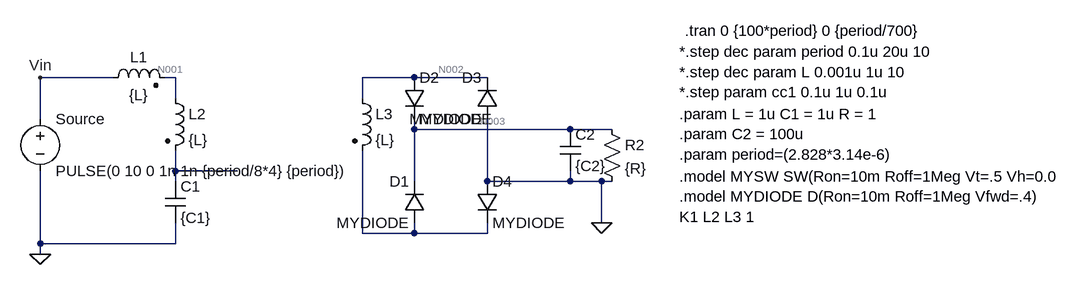
[diagram p0: schematic resonance_study.asc]
resonance_study.asc, the LTspice schematic file:
Version 4
SHEET 1 1688 680
WIRE -16 96 -128 96
WIRE 80 96 64 96
WIRE 448 96 368 96
WIRE 560 96 448 96
WIRE 80 128 80 96
WIRE 368 128 368 96
WIRE -128 160 -128 96
WIRE 448 176 448 160
WIRE 688 176 448 176
WIRE 752 176 688 176
WIRE 80 240 80 208
WIRE 176 240 80 240
WIRE 80 256 80 240
WIRE 448 256 448 176
WIRE 560 256 560 160
WIRE 688 256 688 240
WIRE 688 256 560 256
WIRE 736 256 688 256
WIRE 752 256 736 256
WIRE 736 320 736 256
WIRE 368 336 368 208
WIRE 448 336 448 320
WIRE 448 336 368 336
WIRE 560 336 560 320
WIRE 560 336 448 336
WIRE -128 352 -128 240
WIRE 80 352 80 320
WIRE 80 352 -128 352
WIRE -128 368 -128 352
FLAG -128 368 0
FLAG -128 96 Vin
FLAG 736 320 0
SYMBOL voltage -128 144 R0
WINDOW 123 0 0 Left 2
WINDOW 39 0 0 Left 2
SYMATTR InstName Source
SYMATTR Value PULSE(0 10 0 1n 1n {period/8*4} {period})
SYMBOL cap 64 256 R0
SYMATTR InstName C1
SYMATTR Value {C1}
SYMBOL ind2 -32 112 R270
WINDOW 0 32 56 VTop 2
WINDOW 3 5 56 VBottom 2
SYMATTR InstName L1
SYMATTR Value {L}
SYMATTR Type ind
SYMBOL ind2 64 112 R0
SYMATTR InstName L2
SYMATTR Value {L}
SYMATTR Type ind
SYMBOL ind2 352 112 R0
SYMATTR InstName L3
SYMATTR Value {L}
SYMATTR Type ind
SYMBOL res 736 160 R0
SYMATTR InstName R2
SYMATTR Value {R}
SYMBOL diode 464 320 R180
WINDOW 0 24 64 Left 2
WINDOW 3 24 0 Left 2
SYMATTR InstName D1
SYMATTR Value MYDIODE
SYMBOL diode 432 96 R0
SYMATTR InstName D2
SYMATTR Value MYDIODE
SYMBOL diode 576 160 R180
WINDOW 0 24 64 Left 2
WINDOW 3 24 0 Left 2
SYMATTR InstName D3
SYMATTR Value MYDIODE
SYMBOL diode 544 256 R0
SYMATTR InstName D4
SYMATTR Value MYDIODE
SYMBOL cap 672 176 R0
SYMATTR InstName C2
SYMATTR Value {C2}
TEXT 864 24 Left 2 !.tran 0 {100*period} 0 {period/700}
TEXT 856 248 Left 2 !.model MYSW SW(Ron=10m Roff=1Meg Vt=.5 Vh=0.0\n.model MYDIODE D(Ron=10m Roff=1Meg Vfwd=.4)\nK1 L2 L3 1
TEXT 856 56 Left 2 !*.step dec param period 0.1u 20u 10\n*.step dec param L 0.001u 1u 10\n*.step param cc1 0.1u 1u 0.1u
TEXT 856 152 Left 2 !.param L = 1u C1 = 1u R = 1\n.param C2 = 100u\n.param period=(2.828*3.14e-6)

The netlist it stands for:
* resonance_study.asc
V§Source Vin 0 PULSE(0 10 0 1n 1n {period/8*4} {period})
C1 N004 0 {C1}
L1 Vin N001 {L}
L2 N001 N004 {L}
L3 N002 N005 {L}
R2 N003 0 {R}
D1 N005 N003 MYDIODE
D2 N002 N003 MYDIODE
D3 0 N002 MYDIODE
D4 0 N005 MYDIODE
C2 N003 0 {C2}
.model D D
.lib standard.dio
.tran 0 {100*period} 0 {period/700}
.model MYSW SW(Ron=10m Roff=1Meg Vt=.5 Vh=0.0
.model MYDIODE D(Ron=10m Roff=1Meg Vfwd=.4)
K1 L2 L3 1
*.step dec param period 0.1u 20u 10
*.step dec param L 0.001u 1u 10
*.step param cc1 0.1u 1u 0.1u
.param L = 1u C1 = 1u R = 1
.param C2 = 100u
.param period=(2.828*3.14e-6)
.backanno
.end

* Results of the author's LTspice run, read from the files saved beside the schematic
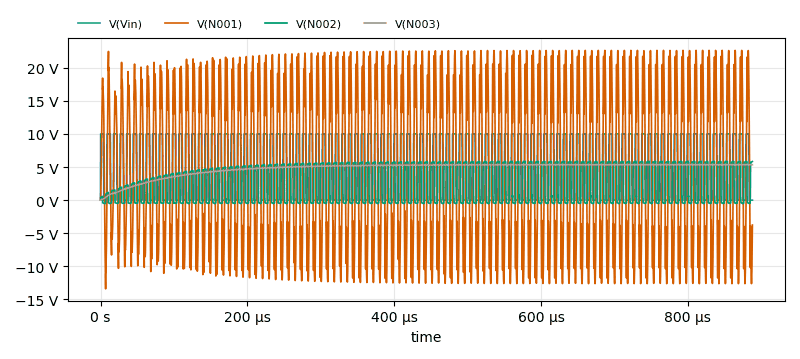
[diagram p1: Transient Analysis of resonance_study.asc, plotted from the saved traces]
* Transient Analysis, 1 run:
*   V(Vin): min 0 V, max 10 V, average 5.001 V, rms 7.072 V, last 0 V
*   V(N001): min -13.42 V, max 22.62 V, average 4.985 V, rms 13.14 V, last -3.734 V
*   V(N002): min -535.2 mV, max 5.873 V, average 2.395 V, rms 3.748 V, last 5.825 V
*   V(N003): min 0 V, max 5.388 V, average 4.787 V, rms 4.905 V, last 5.34 V